# Altium schematic sheet PiHat.SchDoc
size A; SheetNumber: 1; SheetTotal: 1
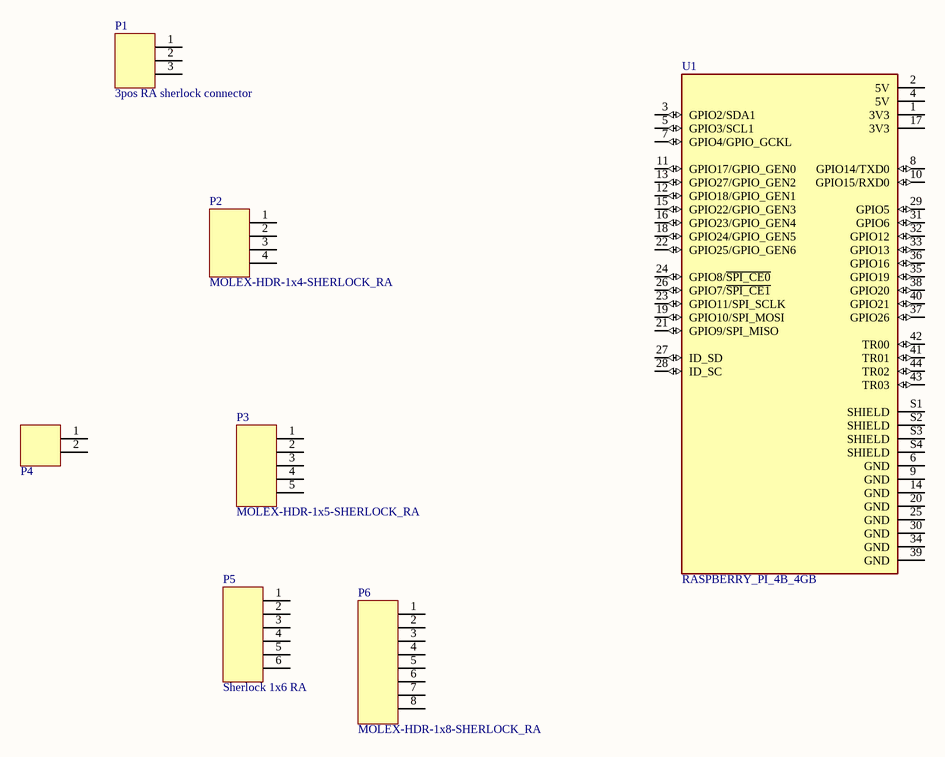
[diagram p0: PiHat.SchDoc]

## Parts
P1  3pos RA sherlock connector  [MOLEX-HDR-1X3-SHERLOCK-RA]
P2  MOLEX-HDR-1x4-SHERLOCK_RA  [MOLEX-HDR-1X4-SHERLOCK-RA]
P3  MOLEX-HDR-1x5-SHERLOCK_RA  [MOLEX-HDR-1X5-SHERLOCK- RA]
P4  2-pin Vert Sherlock  [MOLEX-HDR-1X2-SHERLOCK-VERT]  (value not drawn)
P5  Sherlock 1x6 RA  [MOLEX-HDR-1X6-SHERLOCK- RA]
P6  MOLEX-HDR-1x8-SHERLOCK_RA  [MOLEX-HDR-1X8-SHERLOCK- RA]
U1  RASPBERRY_PI_4B_4GB  [MODULE_RASPBERRY_PI_4B_4GB]

## Nets

Not connected (* = marked no-connect by the designer): P1 1 2 3; P2 1 2 3 4; P3 1 2 3 4 5; P4 1 2; P5 1 2 3 4 5 6; P6 1 2 3 4 5 6 7 8; U1 1(3V3) 2(5V) 3(GPIO2/SDA1) 4(5V) 5(GPIO3/SCL1) 6(GND) 7(GPIO4/GPIO_GCKL) 8(GPIO14/TXD0) 9(GND) 10(GPIO15/RXD0) 11(GPIO17/GPIO_GEN0) 12(GPIO18/GPIO_GEN1) 13(GPIO27/GPIO_GEN2) 14(GND) 15(GPIO22/GPIO_GEN3) 16(GPIO23/GPIO_GEN4) 17(3V3) 18(GPIO24/GPIO_GEN5) 19(GPIO10/SPI_MOSI) 20(GND) 21(GPIO9/SPI_MISO) 22(GPIO25/GPIO_GEN6) 23(GPIO11/SPI_SCLK) 24(GPIO8/~{SPI_CE0}) 25(GND) 26(GPIO7/~{SPI_CE1}) 27(ID_SD) 28(ID_SC) 29(GPIO5) 30(GND) 31(GPIO6) 32(GPIO12) 33(GPIO13) 34(GND) 35(GPIO19) 36(GPIO16) 37(GPIO26) 38(GPIO20) 39(GND) 40(GPIO21) 41(TR01) 42(TR00) 43(TR03) 44(TR02) S1(SHIELD) S2(SHIELD) S3(SHIELD) S4(SHIELD)

## Library data of the parts
P1 = MOLEX-HDR-1x3-SHERLOCK_RA: Header, Molex, 2mm Pitch Sherlock Header, Single Row, Right Angle 3 Circuits, Length 3.3mm; Manufacturer Part Number: 35363-0360; Manufacturer: Molex Connector Corporation; Supplier Part Number 1: WM18932-ND; Supplier 1: Digi-Key
P2 = MOLEX-HDR-1x4-SHERLOCK_RA: Header, Molex, 2mm Pitch Sherlock Header, Single Row, Horizontal, 4 Circuits, Length 3.3mm; Manufacturer Part Number: 0353630460; Supplier Part Number 1: WM18933-ND; Manufacturer: Molex; Supplier 1: Digikey
P3 = MOLEX-HDR-1x5-SHERLOCK_RA: Header, Molex, 2mm Pitch Sherlock Header, Single Row, Vertical, 5 Circuits, Length 3.3mm, 0353620550; Manufacturer Part Number: 0353630560; Supplier Part Number 1: WM18934-ND; Supplier 1: Digikey; Manufacturer: Molex
P4 = MOLEX-HDR-1x2-SHERLOCK_VERT: Header, Molex, 2mm Pitch Sherlock Header, Single Row, Vertical, 2 Circuits, Length 3.3mm, 0353620250; Manufacturer Part Number: *; Order Part Number: *
P5 = MOLEX-HDR-1x6-SHERLOCK_RA: CONN HEADER 6POS 2MM R/A TIN; Supplier 1: Digi-Key; Supplier Part Number 1: WM18935-ND
P6 = MOLEX-HDR-1x8-SHERLOCK_RA: CONN HEADER 8POS 2MM R/A TIN; Supplier 1: Digi-Key; Supplier Part Number 1: WM18937-ND
U1 = RASPBERRY_PI_4B_4GB: BCM2711 Raspberry Pi 4 Model B 4GB - ARMÂ® CortexÂ®-A72 MPU Embedded Evaluation Board; MP: RASPBERRY PI 4B/4GB; Price: None; MF: Raspberry Pi; Check_prices: https://www.snapeda.com/parts/RASPBERRY%20PI%204B/4GB/Raspberry+Pi/view-part/?ref=eda; Value: *; Purchase-URL: https://pricing.snapeda.com/search/part/RASPBERRY PI 4B/4GB/?ref=eda; Availability: In Stock; SnapEDA_Link: https://www.snapeda.com/parts/RASPBERRY%20PI%204B/4GB/Raspberry+Pi/view-part/?ref=snap; Package: None